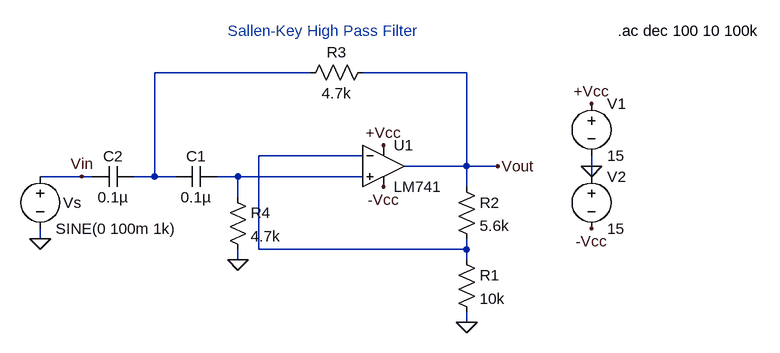
[diagram p0: schematic HPF.asc]
HPF.asc, the LTspice schematic file:
Version 4
SHEET 1 880 680
WIRE 112 0 -128 0
WIRE 352 0 192 0
WIRE 192 128 32 128
WIRE 352 144 352 0
WIRE 352 144 256 144
WIRE 400 144 352 144
WIRE 544 144 544 128
WIRE -240 160 -304 160
WIRE -224 160 -240 160
WIRE -128 160 -128 0
WIRE -128 160 -160 160
WIRE -96 160 -128 160
WIRE 0 160 -32 160
WIRE 192 160 0 160
WIRE 544 160 544 144
WIRE 352 176 352 144
WIRE 0 192 0 160
WIRE -304 256 -304 240
WIRE 32 272 32 128
WIRE 352 272 352 256
WIRE 352 272 32 272
WIRE 0 288 0 272
WIRE 352 288 352 272
WIRE 352 384 352 368
FLAG 544 144 0
FLAG 544 48 +Vcc
FLAG 544 240 -Vcc
FLAG 224 176 -Vcc
FLAG 224 112 +Vcc
FLAG 352 384 0
FLAG -304 256 0
FLAG 400 144 Vout
FLAG 0 288 0
FLAG -240 160 Vin
SYMBOL Opamps\\LM741 224 80 R0
SYMATTR InstName U1
SYMBOL voltage 544 32 R0
SYMATTR InstName V1
SYMATTR Value 15
SYMBOL voltage 544 144 R0
SYMATTR InstName V2
SYMATTR Value 15
SYMBOL res 336 160 R0
SYMATTR InstName R2
SYMATTR Value 5.6k
SYMBOL res 336 272 R0
SYMATTR InstName R1
SYMATTR Value 10k
SYMBOL voltage -304 144 R0
WINDOW 39 0 0 Left 2
WINDOW 0 35 56 Left 2
SYMATTR InstName Vs
SYMATTR Value SINE(0 100m 1k)
SYMATTR Value2 AC 100m 0
SYMBOL res 208 -16 R90
WINDOW 0 0 56 VBottom 2
WINDOW 3 32 56 VTop 2
SYMATTR InstName R3
SYMATTR Value 4.7k
SYMBOL res -16 176 R0
SYMATTR InstName R4
SYMATTR Value 4.7k
SYMBOL cap -160 144 R90
WINDOW 0 0 32 VBottom 2
WINDOW 3 32 32 VTop 2
SYMATTR InstName C2
SYMATTR Value 0.1µ
SYMBOL cap -32 144 R90
WINDOW 0 0 32 VBottom 2
WINDOW 3 32 32 VTop 2
SYMATTR InstName C1
SYMATTR Value 0.1µ
TEXT 584 -64 Left 2 !.ac dec 100 10 100k
TEXT -16 -64 Left 2 ;Sallen-Key High Pass Filter

The netlist it stands for:
* HPF.asc
XU1 N003 N002 +Vcc -Vcc Vout LM741  ; pins In+ In- V+ V- OUT
V1 +Vcc 0 15
V2 0 -Vcc 15
R2 Vout N002 5.6k
R1 N002 0 10k
Vs Vin 0 SINE(0 100m 1k) AC 100m 0
R3 Vout N001 4.7k
R4 N003 0 4.7k
C2 N001 Vin 0.1µ
C1 N003 N001 0.1µ
.ac dec 100 10 100k
* Sallen-Key High Pass Filter
.lib LM741.lib
.backanno
.end